# EAGLE design untitled (EAGLE 6.1)
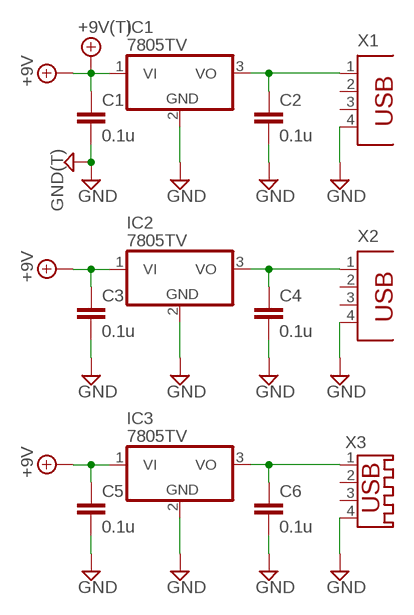
[diagram p0: schematic, sheet 1]

## Parts
+9V1  +9V(T)  [SQUARE]
C1  0.1u  075X0354  [075X035_4]
C2  0.1u  075X0354  [075X035_4]
C3  0.1u  075X0354  [075X035_4]
C4  0.1u  075X0354  [075X035_4]
C5  0.1u  075X0354  [075X035_4]
C6  0.1u  075X0354  [075X035_4]
GND1  GND(T)  [SQUARE]
IC1  7805TV  [TO220V]
IC2  7805TV  [TO220V]
IC3  7805TV  [TO220V]
X1  PN87520  [PN87520]
X2  PN87520  [PN87520]
X3  USB-A003  [USB-A003]

## Nets
+9V: +9V1.1(+9V) C1.1 C3.1 C5.1 IC1.1(VI) IC2.1(VI) IC3.1(VI)
GND: C1.2 C2.2 C3.2 C4.2 C5.2 C6.2 GND1.1(GND) IC1.2(GND) IC2.2(GND) IC3.2(GND) X1.4 X2.4 X3.4
N$1: C2.1 IC1.3(VO) X1.1
N$2: C4.1 IC2.3(VO) X2.1
N$3: C6.1 IC3.3(VO) X3.1
Unconnected: X1.2 X1.3 X2.2 X2.3 X3.2 X3.3

## Library data of the parts
+9V1 = gm-supply:+9V(T): +9V Voltage Supply use this to hook up +9v throughout a schematic instead of running wire automatically labels the net "+9v" adds a hookup pad to the circuit board
C1-C6 = gm-caps-film-chicklet:075X035: 0.027 - 0.033uF Panasonic ECQ-B 7mm x 4mm 50 or 63V: 0.027 - 0.033uF;
GND1 = gm-supply:GND(T): Ground use this to hook up ground (GND) throughout a schematic instead of running wire automatically labels the net "GND" adds a hookup pad to the circuit board (you can use several)
IC1-IC3 = linear:78*: Positive VOLTAGE REGULATOR Source: http://cache.national.com/ds/LM/LM78L05.pdf http://www.fairchildsemi.com/ds/LM/LM7805.pdf
X1 X2 = con-berg:PN87520: BERG USB connector; OC_FARNELL: unknown; OC_NEWARK: unknown
X3 = con-yamaichi:USB-A003: USB connector; OC_FARNELL: unknown; OC_NEWARK: unknown

## Board
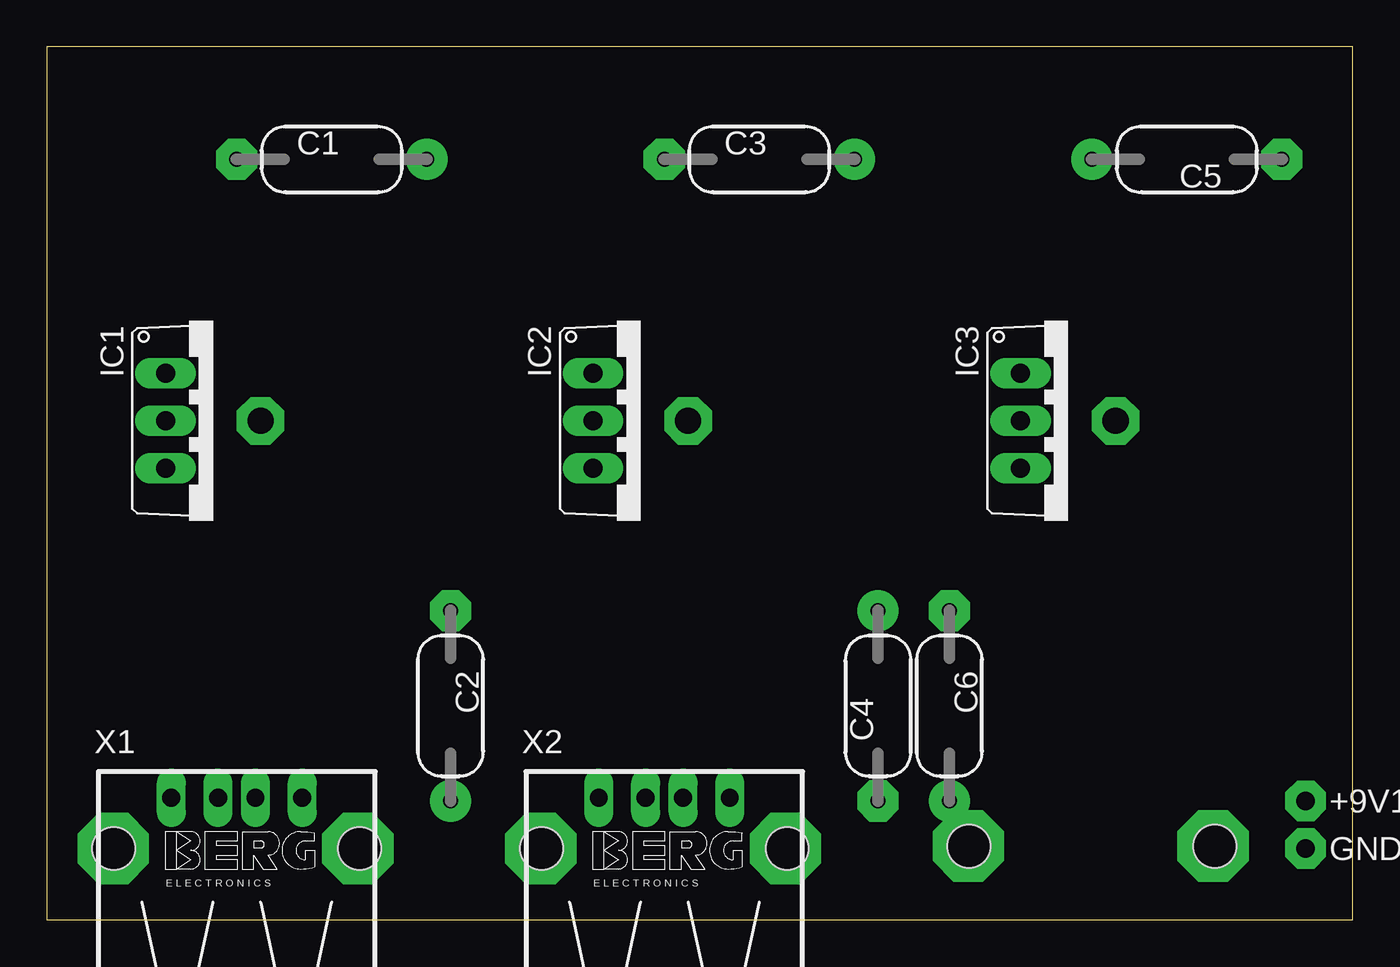
[diagram p1: board, top side]
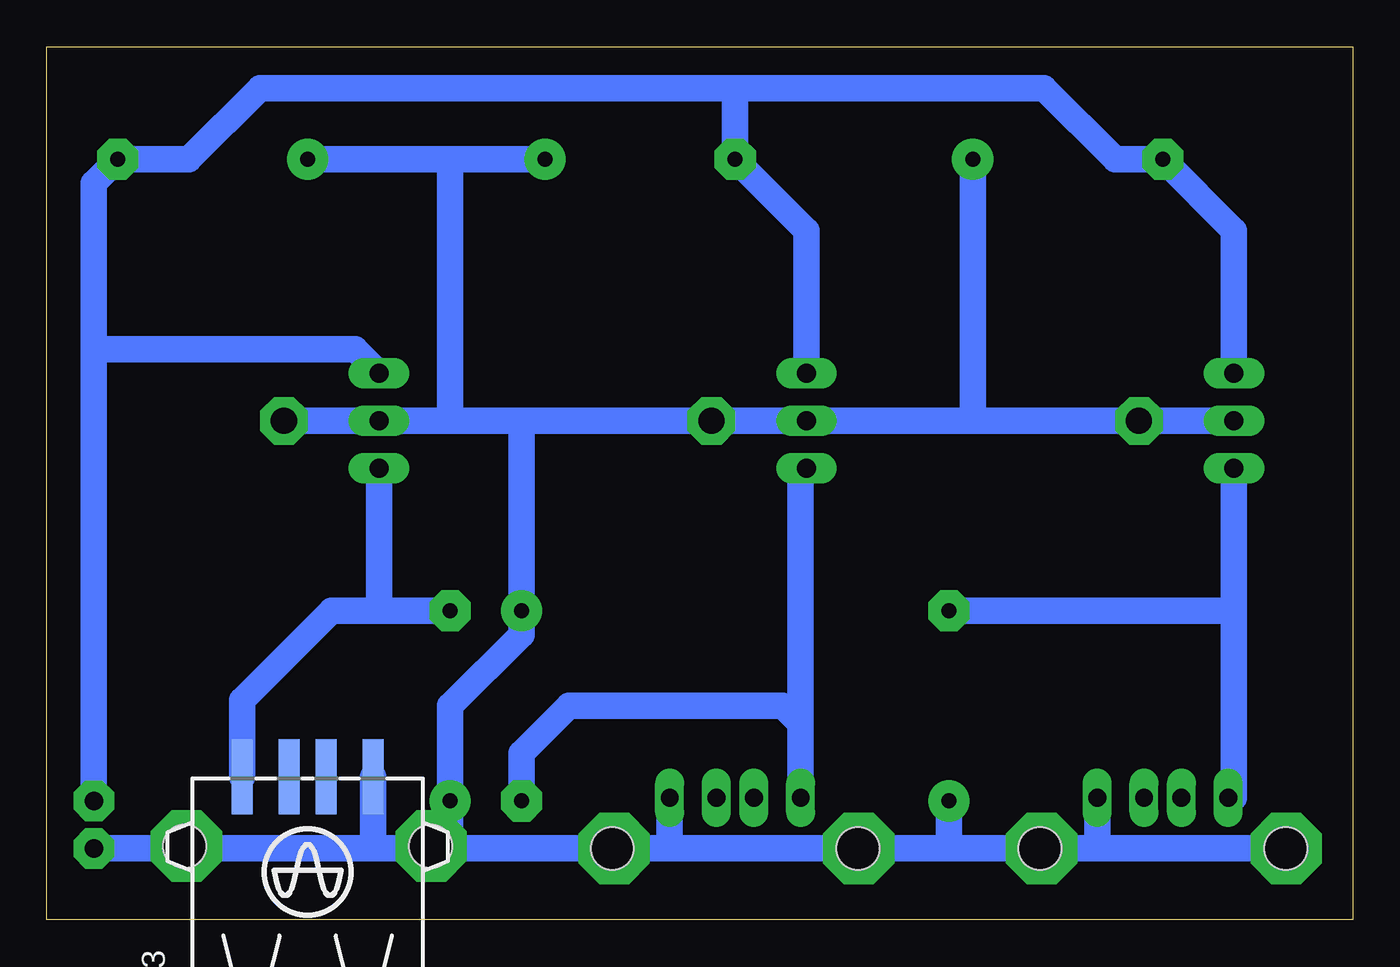
[diagram p2: board, bottom side, seen from below]

Size 69.83 x 46.66 mm. Coordinates in mm from the lower left corner, seen from the top.
Outline: 0,0 69.83,0 69.83,46.66 0,46.66 0,0
Copper layers (1*16): Top 0.035mm / dielectric 1.5mm / Bottom 0.035mm
Design rules: minimum track width 8mil, minimum drill 24mil, track to track 8mil, track to pad 8mil, pad to pad 8mil, via to via 8mil, smd to smd 8mil, copper to edge 40mil, drill to drill 40mil, minimum pad ring 12mil, minimum via ring 12mil, stop-mask expansion 4mil, vias tented up to drill 0mil, thermal gap 10mil

### Footprints (pad centres in the part's own frame; a part is rotated, then mirrored left to right if it is on the bottom)
SQUARE = drill 1 pad 2.18 octagon: 1 0,0
075X035_4 = drill 0.8 pad 2.2 octagon: 1 -5.08,0 | drill 0.8 pad 2.2: 2 5.08,0
TO220V = drill 1.016 long: 1 -2.54,-2.54; 2 0,-2.54; 3 2.54,-2.54
PN87520 = drill 0.95 long: 1 -3.5,2.71; 2 -1,2.71; 3 1,2.71; 4 3.5,2.71 | hole 2.3: -6.57,0; 6.57,0
USB-A003 = smd 1.12 x 4: 1 -3.5,14; 2 -1,14; 3 1,14; 4 3.5,14 | hole 2.3: -6.57,10.28; 6.57,10.28

### Placement (x,y rotation side)
+9V1  67.31,6.35 0 top
C1  15.24,40.64 0 top
C2  21.59,11.43 270 top
C3  38.1,40.64 0 top
C4  44.45,11.43 90 top
C5  60.96,40.64 180 top
C6  48.26,11.43 270 top
GND1  67.31,3.81 0 top
IC1  8.89,26.67 270 top
IC2  31.75,26.67 270 top
IC3  54.61,26.67 270 top
X1  10.16,3.81 0 top
X2  33.02,3.81 0 top
X3  55.88,-6.35 0 bottom

### Tracks (layer width: path | path; a pad name or v marks a point on that pad's centre or on a via)
+9V
  Bottom 1.422: IC1.1 6.35,36.83 C1.1 12.7,40.64 16.51,44.45 33.02,44.45 | 33.02,44.45 58.42,44.45 62.23,40.64 C5.1 67.31,39.37 67.31,29.21 | 33.02,44.45 C3.1 29.21,36.83 IC2.1 | +9V1.1 67.31,29.21 | IC3.1 53.34,30.48 67.31,30.48 67.31,29.21
GND  (via drill 1.4 pad 2.54)
  Bottom 1.422: C2.2 21.59,3.81 | 3.81,3.81 13.97,3.81 | 13.97,3.81 21.59,3.81 | 21.59,3.81 36.83,3.81 | 36.83,3.81 48.26,3.81 | GND1.1 52.07,3.81 | 52.07,3.81 48.26,3.81 | 48.26,3.81 C6.2 48.26,11.43 44.45,15.24 C4.2 44.45,26.67 | X3.4 52.38,4.12 52.07,3.81 | X2.4 36.52,4.12 36.83,3.81 | C3.2 48.26,40.64 | 48.26,40.64 C5.2 | 48.26,26.67 44.45,26.67 | 48.26,26.67 IC3.2 v57.15,26.67 | 48.26,26.67 48.26,40.64 | 44.45,26.67 IC2.2 20.32,26.67 | C1.2 20.32,26.67 | IC1.2 v11.43,26.67 20.32,26.67 | X1.4 13.66,4.12 13.97,3.81
  other vias: 34.29,26.67
N$1
  Bottom 1.422: X1.1 6.35,6.52 6.35,16.51 | C2.1 6.35,16.51 | 6.35,16.51 IC1.3
N$2
  Bottom 1.422: IC2.3 29.52,23.82 X2.1 29.52,10.47 30.48,11.43 41.91,11.43 44.45,8.89 C4.1
N$3
  Bottom 1.422: X3.1 59.38,11.74 54.61,16.51 52.07,16.51 | IC3.3 52.07,16.51 | 52.07,16.51 C6.1
N$4  (via drill 2.2 pad 3.81)
  other vias: 16.64,3.81 3.56,3.81 26.42,3.81 39.5,3.81 49.28,3.94 62.36,3.94